# Altium schematic sheet PressureConnector_2.SchDoc
size B
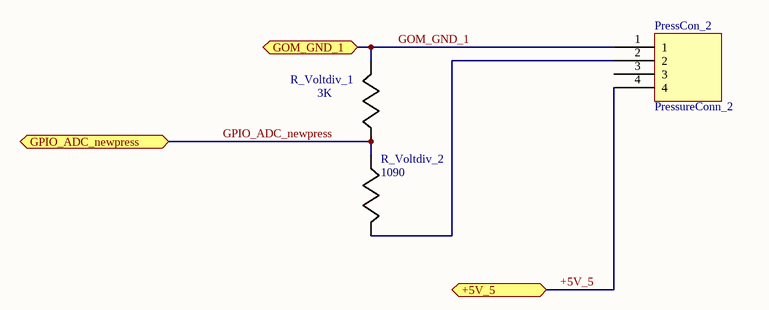
[diagram p0: PressureConnector_2.SchDoc]

## Parts
PressCon_2  PressureConn_2  [PressCon_2]
R_Voltdiv_1  3K  [0402]
R_Voltdiv_2  1090  [0402]

## Ports
+5V_5 (bidir), GOM_GND_1 (bidir), GPIO_ADC_newpress (bidir)

## Nets
+5V_5: PressCon_2.4 ; port +5V_5
GOM_GND_1: PressCon_2.1 R_Voltdiv_1.1 ; port GOM_GND_1
GPIO_ADC_newpress: R_Voltdiv_1.2 R_Voltdiv_2.2 ; port GPIO_ADC_newpress
NetPressCon_2_2: PressCon_2.2 R_Voltdiv_2.1

Not connected (* = marked no-connect by the designer): PressCon_2 3

## Library data of the parts
R_Voltdiv_1 = CRCW040210R0FKED: Imported; Vendor: Vishay-Dale; Value: 3000; Manufacturer_Part_Number: CRCW040210R0FKED; Manufacturer_Name: Vishay-Dale; RefDes: RefDes; TYPE: TYPE
R_Voltdiv_2 = CRCW040210R0FKED: Imported; Vendor: Vishay-Dale; Manufacturer_Part_Number: CRCW040210R0FKED; Manufacturer_Name: Vishay-Dale; RefDes: RefDes; TYPE: TYPE; Value: 1090